# EAGLE design JDM2_Basic_2 (EAGLE 7.7.0)
JDM2 Basic Design
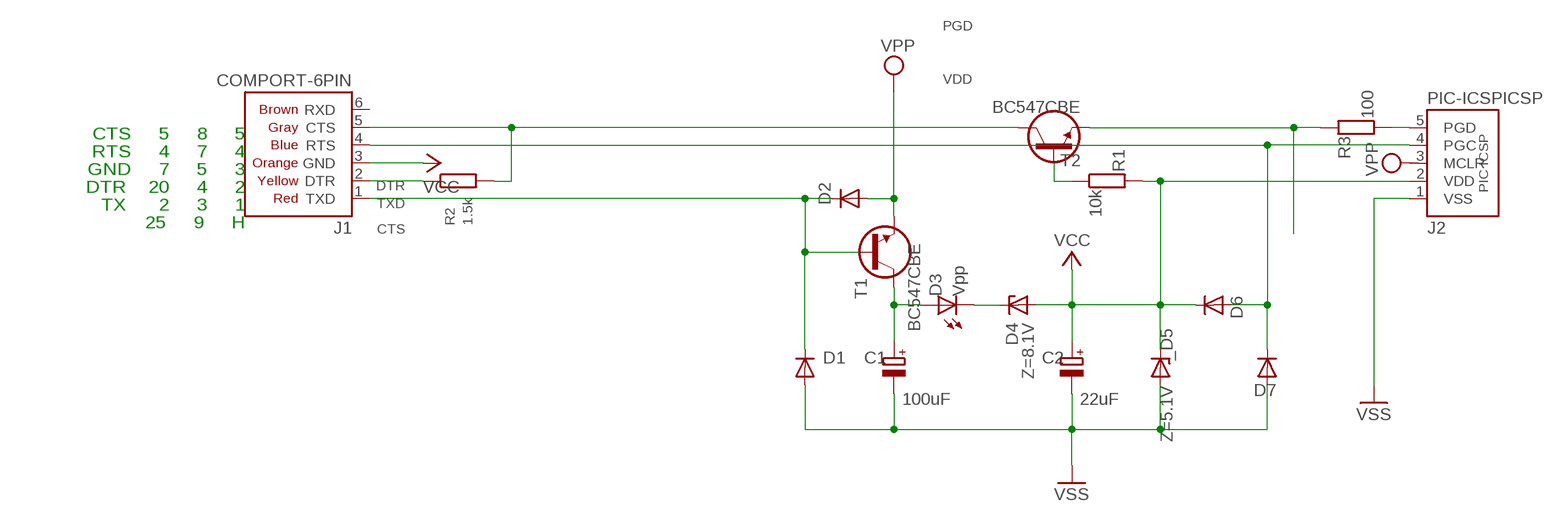
[diagram p0: schematic, sheet 1]

## Parts
_D5  Z=5.1V  Z-DIODEZ2_54  [DO35Z2_54]
C1  100uF  CPOLE5-4  [E5-4]
C2  22uF  CPOLE2,5-4  [E2,5-4]
D1  1N4148  1N414834-2,5-A  [DO34-2,5-A]
D2  1N4148  1N414834-7  [DO34-7]
D3  Vpp  LED3MM  [LED3MM]
D4  Z=8.1V  Z-DIODE34Z7  [DO34Z7]
D6  1N4148  1N414834-5  [DO34-5]
D7  1N4148  1N414834-7  [DO34-7]
J1  COMPORT-6PIN  [RS232-6PIN]
J2  PIC-ICSPICSP  [PIC-ICSP]
R1  10k  R0202/7  [0202/7]
R2  1.5k  R0202/7  [0202/7]
R3  100  R0202/5  [0202/5]
T1  BC547CBE  [TO92-CBE]
T2  BC547CBE  [TO92-CBE]

## Nets
/MCLR: D2.A J2.3(MCLR) T1.E ; supply symbol labelled VPP
CLK: D6.A D7.C J1.4(RTS) J2.4(PGC)
CTS: J1.5(CTS) R2.2 T2.C
DATA: R3.2 T2.E
DTR: J1.2(DTR) R2.1
N$1: R1.1 T2.B
N$5: D3.K(C) D4.C
PGD: J2.5(PGD) R3.1
TXD: D1.C D2.C J1.1(TXD) T1.B
VDD: _D5.C C2.+ D4.A D6.C J1.3(GND) J2.2(VDD) R1.2 ; supply symbol labelled VCC
VPP: C1.+ D3.A T1.C
VSS: _D5.A C1.- C2.- D1.A D7.A J2.1(VSS)
Unconnected: J1.6(RXD)

## Notes on the sheet
- CTS     5     8     5
- RTS     4     7     4
- GND     7     5     3
- DTR    20     4     2
- TX      2     3     1
- 25     9     H

## Library data of the parts
_D5 D4 = d:Z-DIODE
C1 C2 = c:CPOL: POLARIZED CAPACITOR, European symbol
D1 D2 D6 D7 = d:1N4148
D3 = led:LED: LED OSRAM: - CHIPLED LG R971, LG N971, LY N971, LG Q971, LY Q971, LO R971, LY R971 LH N974, LH R974 LS Q976, LO Q976, LY Q976 LO Q996 - Hyper CHIPLED LW Q18S LB Q993, LB Q99A, LB R99A - SideLED LS A670, LO A670, LY A670, LG A670, LP A670 LB A673, LV A673, LT A673, LW A673 LH A674 LY A675 LS A676, LA A676, LO A676, LY A676, LW A676 LS A679, LY A679, LG A679 - Hyper Micro SIDELED® LS Y876, LA Y876, LO Y876, LY Y876 LT Y87S - SmartLED LW L88C, LW L88S LB L89C, LB L89S, LG L890 LS L89K, LO L89K, LY L89K LS L896, LA L896, LO L896, LY L896 - TOPLED LS T670, LO T670, LY T670, LG T670, LP T670 LSG T670, LSP T670, LSY T670, LOP T670, LYG T670 LG T671, LOG T671, LSG T671 LB T673, LV T673, LT T673, LW T673 LH T674 LS T676, LA T676, LO T676, LY T676, LB T676, LH T676, LSB T676, LW T676 LB T67C, LV T67C, LT T67C, LS T67K, LO T67K, LY T67K, LW E67C LS E67B, LA E67B, LO E67B, LY E67B, LB E67C, LV E67C, LT E67C LW T67C LS T679, LY T679, LG T679 LS T770, LO T770, LY T770, LG T770, LP T770 LB T773, LV T773, LT T773, LW T773 LH T774 LS E675, LA E675, LY E675, LS T675 LS T776, LA T776, LO T776, LY T776, LB T776 LHGB T686 LT T68C, LB T68C - Hyper Mini TOPLED® LB M676 - Mini TOPLED Santana® LG M470 LS M47K, LO M47K, LY M47K Source: http://www.osram.convergy.de LUXEON: - LUMILED® LXK2-PW12-R00, LXK2-PW12-S00, LXK2-PW14-U00, LXK2-PW14-V00 LXK2-PM12-R00, LXK2-PM12-S00, LXK2-PM14-U00 LXK2-PE12-Q00, LXK2-PE12-R00, LXK2-PE12-S00, LXK2-PE14-T00, LXK2-PE14-U00 LXK2-PB12-K00, LXK2-PB12-L00, LXK2-PB12-M00, LXK2-PB14-N00, LXK2-PB14-P00, LXK2-PB14-Q00 LXK2-PR12-L00, LXK2-PR12-M00, LXK2-PR14-Q00, LXK2-PR14-R00 LXK2-PD12-Q00, LXK2-PD12-R00, LXK2-PD12-S00 LXK2-PH12-R00, LXK2-PH12-S00 LXK2-PL12-P00, LXK2-PL12-Q00, LXK2-PL12-R00 Source: www.luxeon.com KINGBRIGHT: KA-3528ASYC Source: www.kingbright.com
J1 = pinconn:COMPORT-6PIN
J2 = pinconn:PIC-ICSP
R1-R3 = r:R: RESISTOR, European symbol
T1 T2 = t:BC547

## Net classes
0 default: width 0.559 mm
1 power: width 0.559 mm

## Board
JDM2 Basic Design
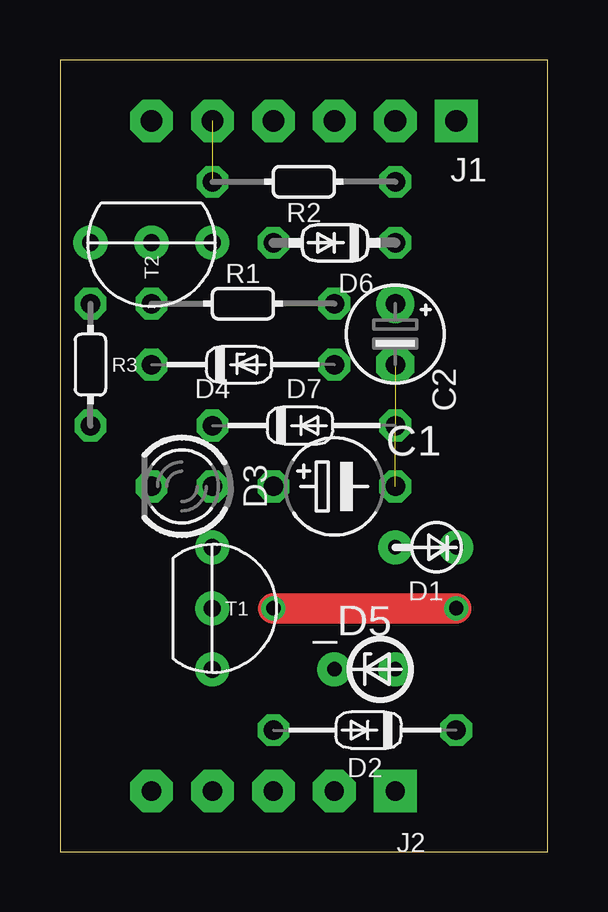
[diagram p1: board, top side]
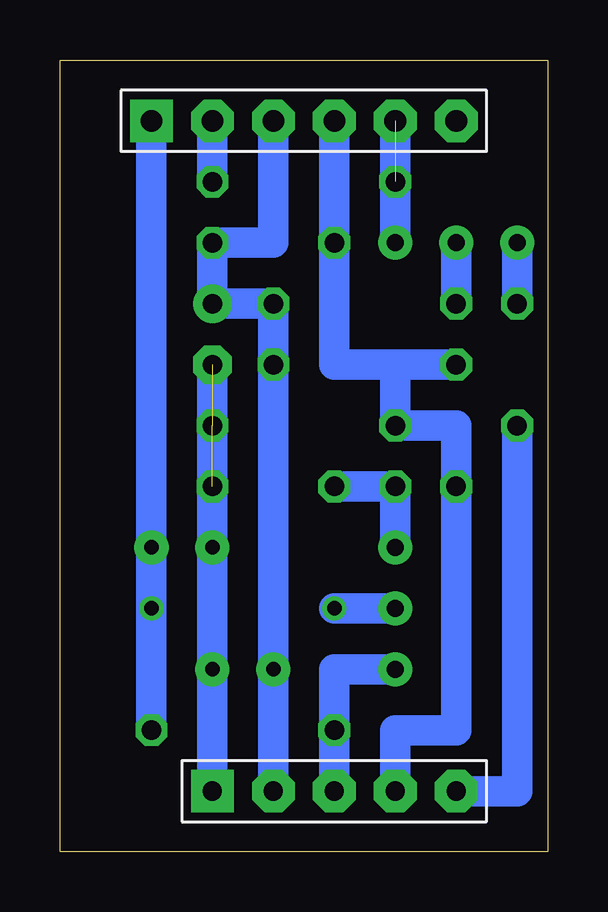
[diagram p2: board, bottom side, seen from below]

Size 20.32 x 33.02 mm. Coordinates in mm from the lower left corner, seen from the top.
Outline: 0,0 20.32,0 20.32,33.02 0,33.02 0,0
Copper layers (1*16): Top 0.035mm / dielectric 1.5mm / Bottom 0.035mm
Design rules "default": minimum track width 10mil, minimum drill 24mil, track to track 8mil, track to pad 8mil, pad to pad 8mil, via to via 8mil, smd to smd 8mil, copper to edge 40mil, drill to drill 8mil, minimum pad ring 10mil, minimum via ring 8mil, stop-mask expansion 4mil, vias tented up to drill 0mil, thermal gap 10mil

### Footprints (pad centres in the part's own frame; a part is rotated, then mirrored left to right if it is on the bottom)
DO35Z2_54 = drill 0.6 pad 1.422: A 1.27,0; C -1.27,0
E5-4 = drill 0.813 octagon: + -2.54,0; - 2.54,0
E2,5-4 = drill 0.813 pad 1.6: + 1.27,0 | drill 0.813 pad 1.6 octagon: - -1.27,0
DO34-2,5-A = drill 0.6 pad 1.422: A 1.27,0; C -1.27,0
DO34-7 = drill 0.813 octagon: A 3.81,0; C -3.81,0
LED3MM = drill 0.813 octagon: A -1.27,0; K 1.27,0
DO34Z7 = drill 0.813 octagon: A 3.81,0; C -3.81,0
DO34-5 = drill 0.813 octagon: A 2.54,0; C -2.54,0
RS232-6PIN = drill 0.9 pad 1.778 square: 1 0,0 | drill 0.9 pad 1.778 octagon: 2 2.54,0; 3 5.08,0; 4 7.62,0; 5 10.16,0; 6 12.7,0
PIC-ICSP = drill 0.8 pad 1.778 square: 1 -5.08,0 | drill 0.8 pad 1.778 octagon: 2 -2.54,0; 3 0,0; 4 2.54,0; 5 5.08,0
0202/7 = drill 0.813 octagon: 1 0,-3.81; 2 0,3.81
0202/5 = drill 0.813 octagon: 1 0,-2.54; 2 0,2.54
TO92-CBE = drill 0.7 pad 1.422: B 0,0; C 0,2.54; E 0,-2.54

### Placement (x,y rotation side)
_D5  12.7,7.62 0 top
C1  100μF  [E5-4]  11.43,15.24 0 top
C2  22μF  [E2,5-4]  13.97,21.59 90 top
D1  15.24,12.7 180 top
D2  12.7,5.08 180 top
D3  5.08,15.24 180 top
D4  7.62,20.32 0 top
D6  11.43,25.4 180 top
D7  10.16,17.78 0 top
J1  16.51,30.48 180 top
J2  8.89,2.54 180 top
R1  10kΩ  [0202/7]  7.62,22.86 270 top
R2  1.5kΩ  [0202/7]  10.16,27.94 90 top
R3  100Ω  [0202/5]  1.27,20.32 0 top
T1  6.35,10.16 0 top
T2  3.81,25.4 270 top

### Tracks (layer width: path | path; a pad name or v marks a point on that pad's centre or on a via)
/MCLR
  Bottom 1.27: J2.3 D2.A 8.89,7.62 T1.E
CLK
  Bottom 1.27: J1.4 D6.A 8.89,20.32 6.35,20.32 | J2.4 6.35,5.08 3.81,5.08 3.81,17.78 D7.C 6.35,20.32 | 6.35,20.32 3.81,20.32
CTS  (1 unrouted)
  Bottom 1.27: J1.5 T2.C
DATA  (via drill 0.6)
  Bottom 1.27: R3.2 T2.E
  other vias: 1.27,22.86 1.27,22.86
DTR
  Bottom 1.27: J1.2 R2.1
N$1
  Bottom 1.27: R1.1 T2.B
N$5
  Bottom 1.27: D4.C 6.35,20.32 6.35,17.78 3.81,17.78 D3.K
PGD
  Bottom 1.27: R3.1 1.27,2.54 J2.5
TXD  (via drill 0.6)
  Top 1.27: v16.51,10.16 v8.89,10.16
  Bottom 1.27: v16.51,10.16 D2.C | v16.51,10.16 J1.1 | D1.C v16.51,10.16 | v8.89,10.16 T1.B
  other vias: 6.35,10.16 6.35,10.16
VDD
  Bottom 1.27: J2.2 _D5.C D4.A R1.2 C2.+ D6.C 11.43,25.4 J1.3
VPP
  Bottom 1.27: T1.C D3.A C1.+
VSS  (2 unrouted)
  Bottom 1.27: C2.- D1.A _D5.A J2.1